# Altium schematic sheet Sheet1.SchDoc
size A4
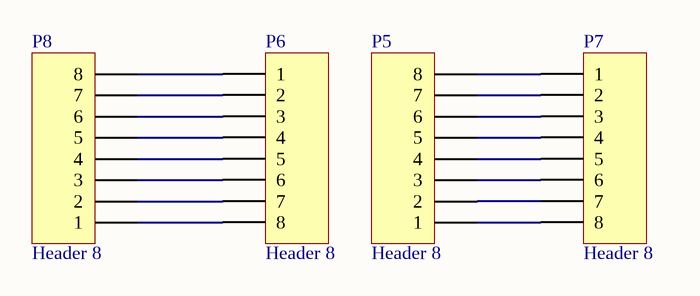
[diagram p0: Sheet1.SchDoc]

## Parts
P5  Header 8  [HDR8]
P6  Header 8  [HDR8]
P7  Header 8  [HDR8]
P8  Header 8  [HDR8]

## Nets
NetP5_1: P5.1 P7.8
NetP5_2: P5.2 P7.7
NetP5_3: P5.3 P7.6
NetP5_4: P5.4 P7.5
NetP5_5: P5.5 P7.4
NetP5_6: P5.6 P7.3
NetP5_7: P5.7 P7.2
NetP5_8: P5.8 P7.1
NetP6_1: P6.1 P8.8
NetP6_2: P6.2 P8.7
NetP6_3: P6.3 P8.6
NetP6_4: P6.4 P8.5
NetP6_5: P6.5 P8.4
NetP6_6: P6.6 P8.3
NetP6_7: P6.7 P8.2
NetP6_8: P6.8 P8.1

## Library data of the parts
P5-P8 = Header 8: Header, 8-Pin; LatestRevisionDate: 17-Jul-2002; LatestRevisionNote: Re-released for DXP Platform.; Publisher: Altium Limited